# EAGLE schematic Power_board (EAGLE 6.5.0)
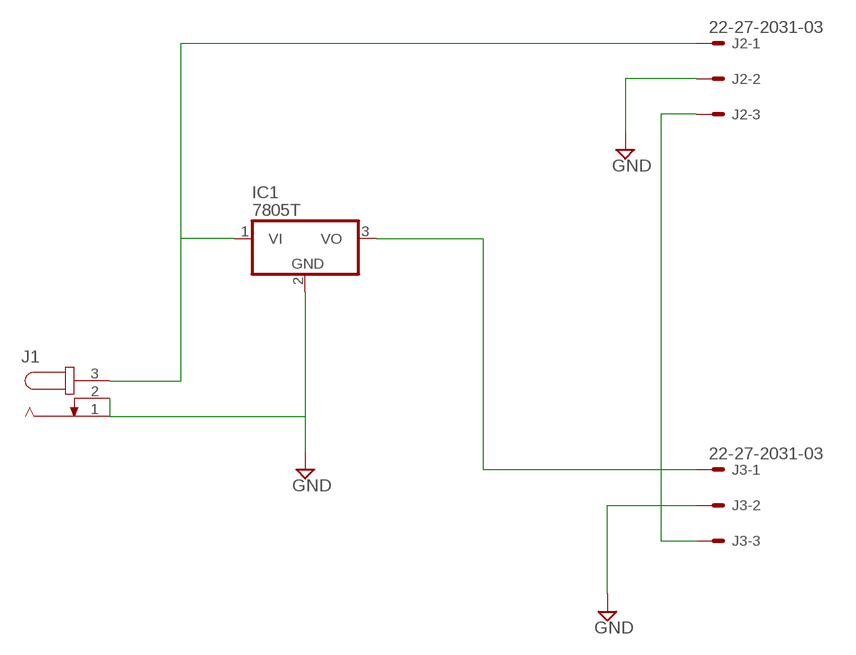
[diagram p0: schematic, sheet 1]

## Parts
IC1  7805T  [TO220H]
J1  JACK-PLUG0  [SPC4077]
J2  22-27-2031-03  [6410-03]
J3  22-27-2031-03  [6410-03]

## Nets
GND: IC1.2(GND) J1.1 J1.2 J2.2 J3.2
N$1: IC1.1(VI) J1.3 J2.1
N$3: J2.3 J3.3
N$4: IC1.3(VO) J3.1

## Library data of the parts
IC1 = linear:78*: Positive VOLTAGE REGULATOR Source: http://cache.national.com/ds/LM/LM78L05.pdf http://www.fairchildsemi.com/ds/LM/LM7805.pdf
J1 = con-jack:JACK-PLUG: DC POWER JACK Power Jack, DC, Right Angle, Through Hole, Rated 5A at 16VDC, PC Terminals Distributor: Farnell (www.Farnell.de) Drawing: 84N1161.pdf / 84N1162.pdf Manufacturer: SPC Technology (www.spctechnology.com) Type: SPC4077 / SPC 4078; OC_FARNELL: unknown; OC_NEWARK: unknown
J2 J3 = con-molex:22-?-03: CONNECTOR wire to board 2.54 mm (.1 inch) pitch header; OC_FARNELL: unknown; OC_NEWARK: unknown